# Altium schematic sheet DOut_Isolator.SchDoc
size A4; DocumentNumber: 4; SheetNumber: 4; SheetTotal: 16
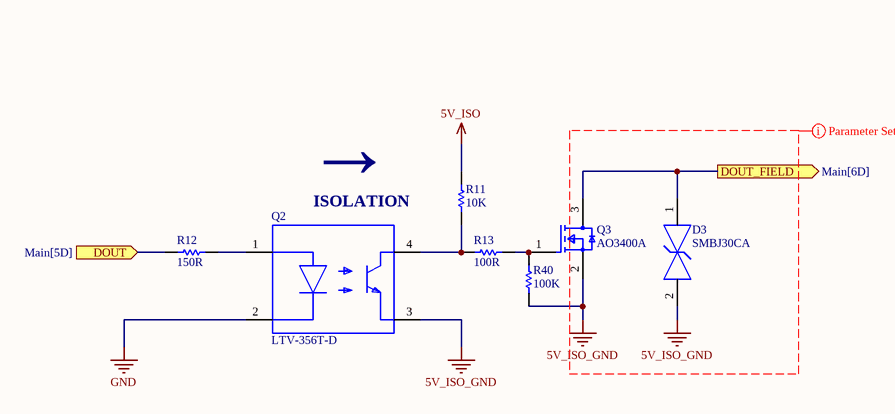
[diagram p0: DOut_Isolator.SchDoc]

## Parts
D3  SMBJ30CA  [FP-SMBJ30CAHE3-52-MFG]
Q2  LTV-356T-D  [FP-LTV-356T-D-MFG]
Q3  AO3400A  [FP-SOT23-MFG]
R11  10K  [RESC1609X55X30LL15T15]
R12  150R  [RESC1608X55X30ML20T20]
R13  100R  [RESC1609X50X30ML8T20]
R40  100K  [RESC1608X55X30ML15T15]

## Ports
DOUT (in, see Main[5D]), DOUT_FIELD (out, see Main[6D])

## Nets
5V_ISO: R11.1
5V_ISO_GND: D3.2 Q2.3(E) Q3.2(S) R40.2
GND: Q2.2(C)
DOUT: R12.1 ; port DOUT
DOUT_FIELD: D3.1 Q3.3(D) ; port DOUT_FIELD
NetQ2_1: Q2.1(A) R12.2
NetQ2_4: Q2.4(C) R11.2 R13.1
NetQ3_1: Q3.1(G) R13.2 R40.1

## Layout directives
net class DOUT_SINKING: 5V_ISO_GND

## Notes on the sheet
- (near Q2) ←
- (near Q2) ISOLATION

## Library data of the parts
D3 = CMP-02577-000018-1: TVS DIODE 30V 48.4V DO214AA; Manufacturer: Vishay Semiconductor Diodes Division; Manufacturer Part Number: SMBJ30CAHE3/52; Peak Pulse Power: 600W; Number Of Channels: 1; Automotive Grade: Grade 0; Peak Pulse Current: 12.4A; Standoff Height: 0mm; Max Junction Temp: +150°C; Breakdown Voltage: 33.3V; Direction: Bidirectional; Octopart: https://octopart.com/smbj30cahe3%2F52-vishay-43725255; Footprint Url: http://www.vishay.com/docs/95401/smb.pdf; Device Class L2: TVS Diodes; RoHS: TRUE; Automotive: Yes; Height: 2.44mm; Temperature: -55°C to +150°C; Category: Diode; ComponentLink2Description: Datasheet; Reverse Standoff Voltage: 30V; Device Class L3: unset; Package: DO-214AA; ComponentLink2URL: http://www.vishay.com/docs/88392/smbj.pdf; Temperature Range Low: -55°C; Mouser Description: Diode TVS Single Bi-Dir 30V 600W 2-Pin DO-214AA T/R; Temperature Range High: +150°C; Digikey Description: TVS DIODE 30V 48.4V DO214AA; Clamping Voltage: 48.4V; Lead Free: Yes; Device Class L1: Circuit Protection
Q2 = CMP-22018-000003-1: OPTOCPL 1 CH TRAN OUT SMT; Manufacturer: Lite-On; Collector Emitter Voltage: 80V; Standoff Height: 0mm; Power Dissipation: 170mW; Forward Current: 20mA; Emiiter Collector Voltage: 6V; Isolation Voltage: 3750Vrms; Max Junction Temp: +125°C; Forward Voltage: 1.2V; Max Current Transfer Ratio: 600%; Min Current Transfer Ratio: 300%; RoHS: TRUE; Device Class L3: unset; Package: LTV-356T-D; Temperature Range High: +110°C; Temperature Range Low: -55°C; Device Class L2: Optocouplers; Reverse Voltage: 6V; Temperature: -55°C to +110°C; Manufacturer Part Number: LTV-356T-D; Category: Trans; ComponentLink2URL: https://ve.mouser.com/datasheet/2/239/LTV-356T%20series%20201610-1139805.pdf; Octopart: https://octopart.com/ltv-356t-d-lite-on-11764243; Automotive: No; Digikey Description: OPTOCPL 1 CH TRAN OUT SMT; ComponentLink2Description: Datasheet; Height: 2.4mm; Device Class L1: Optoelectronics; Lead Free: Yes
Q3 = CMP-83955-000006-1: MOSFET N-CH 30V 5.7A SOT23; Input Capacitance: 630pF; Number of Elements: 1; Rds On Max: 26.5mR; Max Power Dissipation: 1.4W; Gate to Source Voltage (Vgs): 12V; Min Operating Temperature: -55°C; Lead Free: Lead Free; Number of Pins: 3; Drain to Source Voltage (Vdss): 30V; Case/Package: SOT-23; Mount: Surface Mount; Continuous Drain Current (ID): 5.7A; Radiation Hardening: No; Packaging: Tape and Reel; Max Operating Temperature: 150°C; Power Dissipation: 1.4W
R11 = CMP-1012-00623-3: Chip Resistor, 10 KOhm, +/- 1%, 0.1 W, -55 to 155 degC, 0603 (1608 Metric), RoHS, Tape and Reel; Manufacturer: Panasonic; Voltage Rating: 75V; Case\/Package: 0603; Power Rating: 100mW; Resistance: 10KOhm; Temperature Coefficient: 100ppm\/degreesC; Number of Pins: 2; Package Reference: 603; Depth: 0.8mm; Mount: SurfaceMount; Package Description: 2-Pin Surface Mount Device, Body 1.6 x 0.85 mm; Datasheet Version: 02/2017; Length: 1.6mm; Lead Free: LeadFree; Height: 0.45mm; Number of Terminations: 2; Max Power Dissipation: 100mW; Min Operating Temperature: -55degC; Datasheet URL: https://industrial.panasonic.com/cdbs/www-data/pdf/RDA0000/AOA0000C304.pdf; Termination: SMD/SMT; Case Code (Metric): 1608; Case Code (Imperial): 0603; Tolerance: 1%; Max Operating Temperature: 155degC; RoHSCompliant: true; Voltage Rating (DC): 75V; Radiation Hardening: No; Packaging: TapeandReel; Composition: ThickFilm; Mounting Technology: SurfaceMount; Manufacturer URL: http://www.panasonic.com/; Width: 0.031inch; REACH SVHC: NoSVHC; Contact Plating: Tin; Military Standard: Not; Package Quantity: 1
R12 = CMP-2000-00914-1: Part Number: ERA3AEB151V; Manufacturer: Panasonic
R13 = CMP-2000-03824-5: Chip Resistor, 100 Ohm, +/- 1%, 100 mW,-55 to 155 degC, 0603 (1608 Metric), RoHS, Tape and Ree; Manufacturer: Vishay Semiconductor; ComponentLink2URL: http://www.vishay.com/docs/20035/dcrcwe3.pdf; ComponentLink1URL: http://www.vishay.com/; Mounting Technology: Surface Mount; ComponentLink1Description: Manufacturer URL; ComponentLink2Description: Datasheet; PackageDescription: 2-Pin Surface Mount Device, Body 1.575 x 0.85 mm; PackageReference: 0603; DatasheetVersion: 06/2012
R40 = CMP-2000-00182-1: Part Number: ERJ-3EKF1003V; Manufacturer: Panasonic